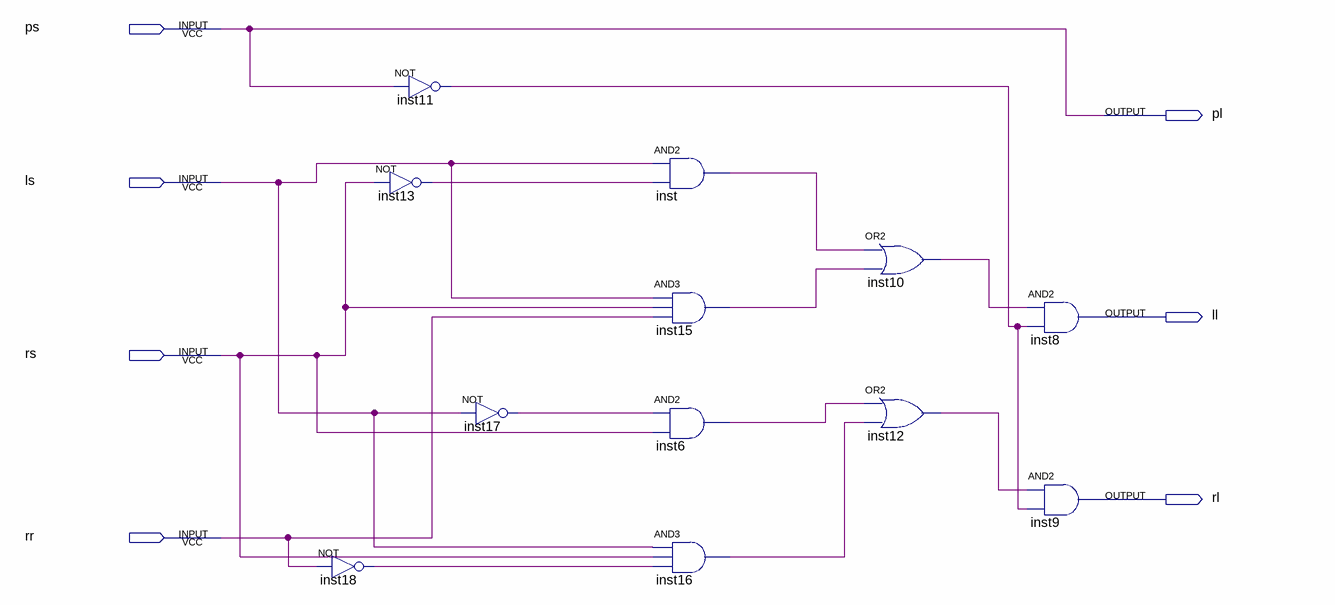
[diagram p0: schematic sheet]
// Quartus schematic Block2.bdf as structural Verilog: 12 symbols, 7 pins
module Block2 (
  input  ps,
  input  ls,
  input  rs,
  input  rr,
  output pl,
  output ll,
  output rl
);

  wire inst6_out, inst10_out, inst11_out, inst12_out, inst13_out, inst15_out, inst16_out, inst17_out,
       inst18_out, inst_out;

  not inst13 (inst13_out, rs);
  not inst18 (inst18_out, rr);
  not inst11 (inst11_out, ps);
  not inst17 (inst17_out, ls);
  and inst (inst_out, ls, inst13_out);
  and inst15 (inst15_out, ls, rs, rr);
  and inst6 (inst6_out, inst17_out, rs);
  and inst16 (inst16_out, ls, rs, inst18_out);
  or inst10 (inst10_out, inst_out, inst15_out);
  or inst12 (inst12_out, inst6_out, inst16_out);
  and inst8 (ll, inst10_out, inst11_out);
  and inst9 (rl, inst12_out, inst11_out);

  assign pl = ps;
endmodule
